# EAGLE design KimCard-r3 (EAGLE 5.11)
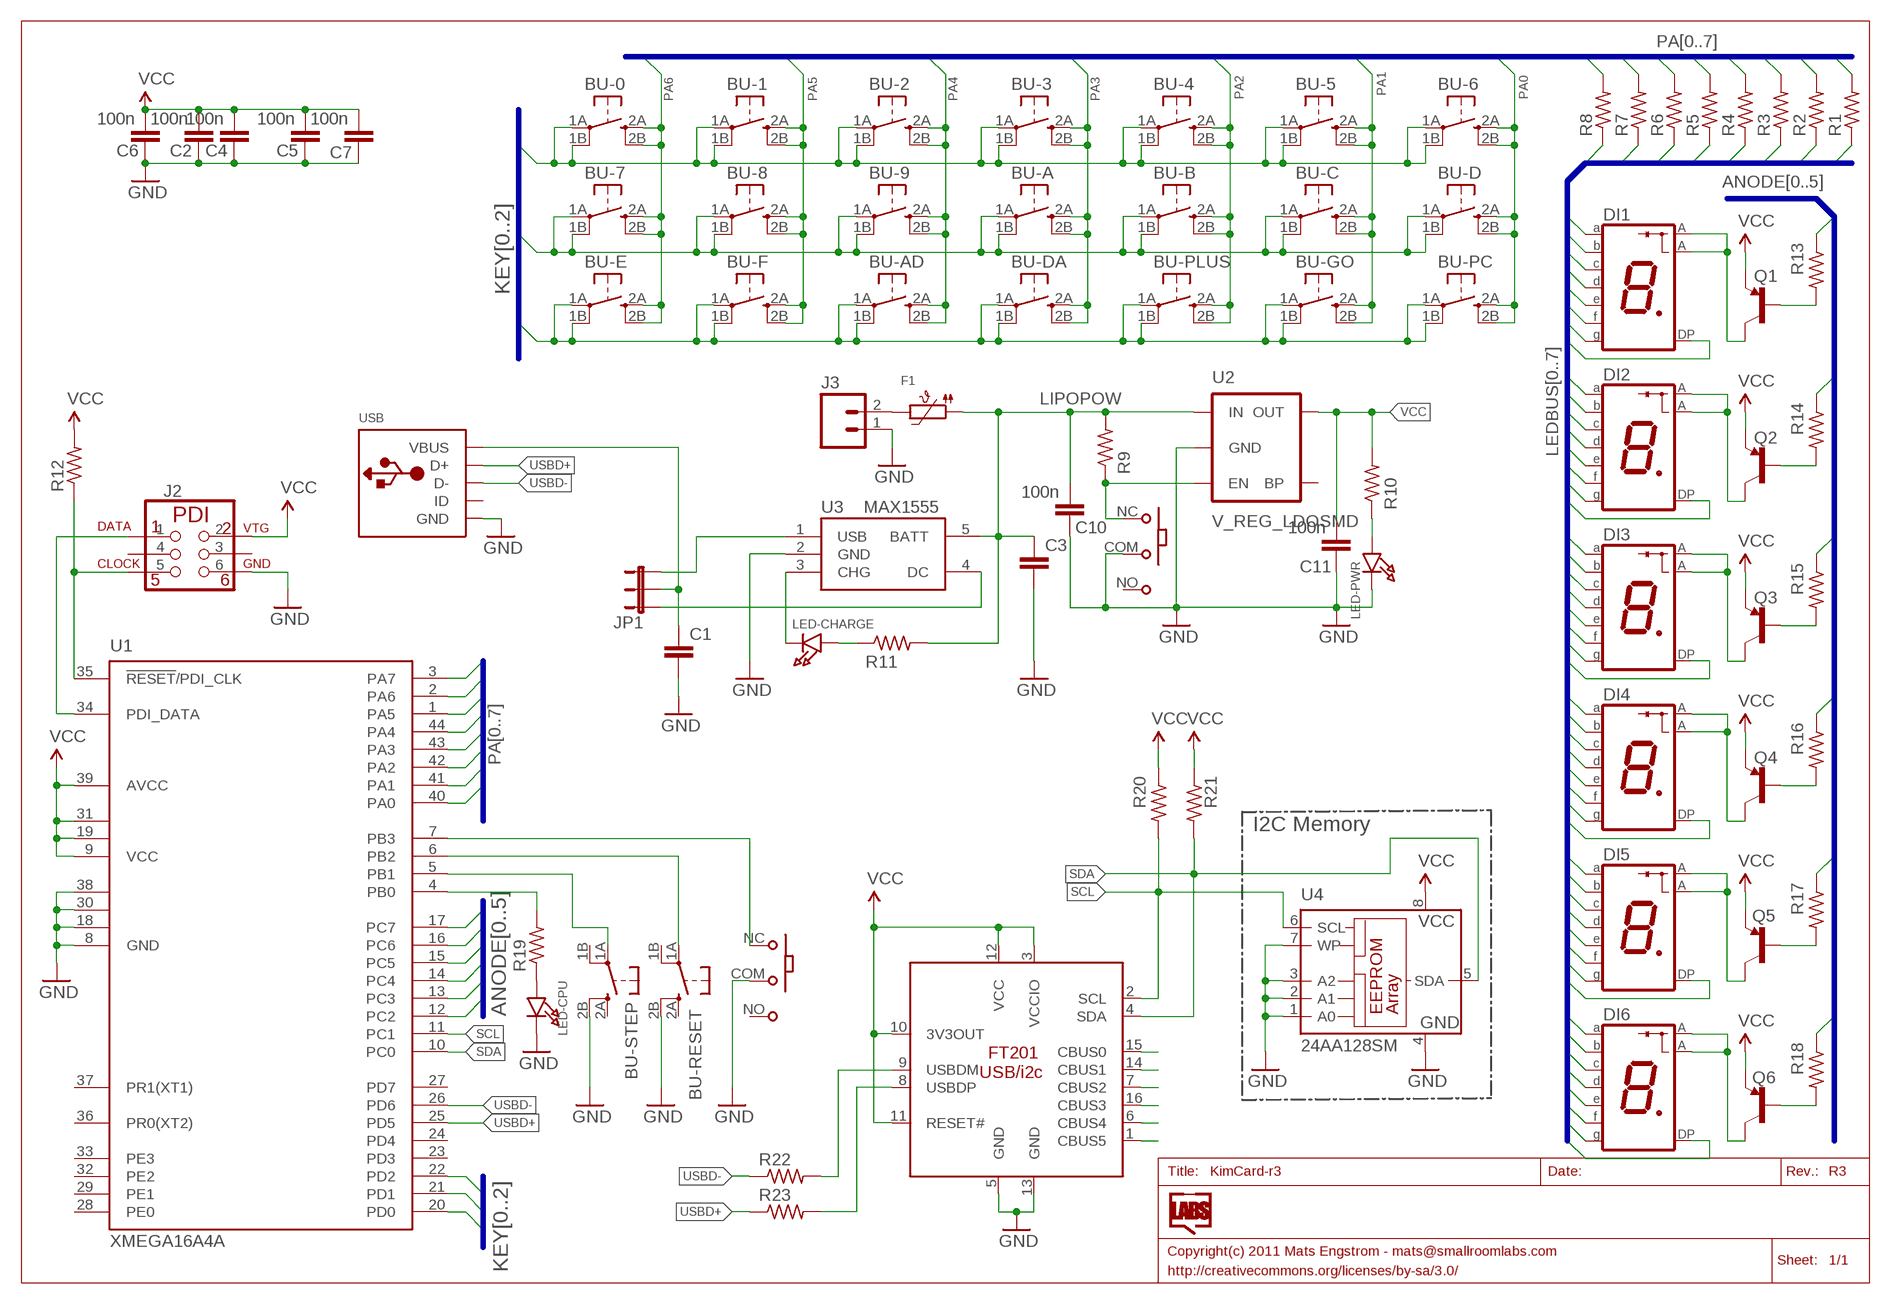
[diagram p0: schematic, sheet 1]

## Parts
BU-0  TACTILETAO1  [EVQ-Q2-TAO1]
BU-1  TACTILETAO1  [EVQ-Q2-TAO1]
BU-2  TACTILETAO1  [EVQ-Q2-TAO1]
BU-3  TACTILETAO1  [EVQ-Q2-TAO1]
BU-4  TACTILETAO1  [EVQ-Q2-TAO1]
BU-5  TACTILETAO1  [EVQ-Q2-TAO1]
BU-6  TACTILETAO1  [EVQ-Q2-TAO1]
BU-7  TACTILETAO1  [EVQ-Q2-TAO1]
BU-8  TACTILETAO1  [EVQ-Q2-TAO1]
BU-9  TACTILETAO1  [EVQ-Q2-TAO1]
BU-A  TACTILETAO1  [EVQ-Q2-TAO1]
BU-AD  TACTILETAO1  [EVQ-Q2-TAO1]
BU-B  TACTILETAO1  [EVQ-Q2-TAO1]
BU-C  TACTILETAO1  [EVQ-Q2-TAO1]
BU-D  TACTILETAO1  [EVQ-Q2-TAO1]
BU-DA  TACTILETAO1  [EVQ-Q2-TAO1]
BU-E  TACTILETAO1  [EVQ-Q2-TAO1]
BU-F  TACTILETAO1  [EVQ-Q2-TAO1]
BU-GO  TACTILETAO1  [EVQ-Q2-TAO1]
BU-PC  TACTILETAO1  [EVQ-Q2-TAO1]
BU-PLUS  TACTILETAO1  [EVQ-Q2-TAO1]
BU-RESET  TACTILETAO1  [EVQ-Q2-TAO1]
BU-STEP  TACTILETAO1  [EVQ-Q2-TAO1]
C1  CAP0805  [0805]
C2  100n  CAP0805  [0805]
C3  CAP0805  [0805]
C4  100n  CAP0805  [0805]
C5  100n  CAP0805  [0805]
C6  100n  CAP0805  [0805]
C7  100n  CAP0805  [0805]
C10  100n  CAP0805  [0805]
C11  100n  CAP0805  [0805]
DI1  7SEG-CA0.3"SMD  [KCSA03]
DI2  7SEG-CA0.3"SMD  [KCSA03]
DI3  7SEG-CA0.3"SMD  [KCSA03]
DI4  7SEG-CA0.3"SMD  [KCSA03]
DI5  7SEG-CA0.3"SMD  [KCSA03]
DI6  7SEG-CA0.3"SMD  [KCSA03]
F1  PTC1812  [PTC1812]
J2  PDI-EXTRA  [ISP-TOUCH-PDI-SOLDER]
J3  LIPO-BAT  M02-JST-2MM-SMT  [JST-2-SMD]
JP1  JUMPER-31-2  [SJ_3_PASTE1&2]
LED-CHARGE  LEDSMD0805  [CHIPLED_0805]
LED-CPU  LEDSMD0805  [CHIPLED_0805]
LED-PWR  LEDSMD0805  [CHIPLED_0805]
Q1  TRANSISTOR_PNPSMD  [SOT23-3]
Q2  TRANSISTOR_PNPSMD  [SOT23-3]
Q3  TRANSISTOR_PNPSMD  [SOT23-3]
Q4  TRANSISTOR_PNPSMD  [SOT23-3]
Q5  TRANSISTOR_PNPSMD  [SOT23-3]
Q6  TRANSISTOR_PNPSMD  [SOT23-3]
R1  RES0805A  [R0805A]
R2  RES0805A  [R0805A]
R3  RES0805A  [R0805A]
R4  RES0805A  [R0805A]
R5  RES0805A  [R0805A]
R6  RES0805A  [R0805A]
R7  RES0805A  [R0805A]
R8  RES0805A  [R0805A]
R9  RES0805A  [R0805A]
R10  RES0805A  [R0805A]
R11  RES0805A  [R0805A]
R12  RES0805A  [R0805A]
R13  RES0805A  [R0805A]
R14  RES0805A  [R0805A]
R15  RES0805A  [R0805A]
R16  RES0805A  [R0805A]
R17  RES0805A  [R0805A]
R18  RES0805A  [R0805A]
R19  RES0805A  [R0805A]
R20  RES0805A  [R0805A]
R21  RES0805A  [R0805A]
R22  RES0805A  [R0805A]
R23  RES0805A  [R0805A]
U1  XMEGA16A4A  [TQFP44]
U2  V_REG_LDOSMD  [SOT23-5]
U3  MAX1555  [SOT23-5]
U4  24AA128SM  [SO-08M]
U5  FT201-SSOP  [SSOP16]
U$1  SLIDESWITCHPCM12SMTR  [PCM12SMTR]
U$2  SLIDESWITCHPCM12SMTR  [PCM12SMTR]
USB  USBMINI-B  [MOLEX67503]

## Nets
CBUS0: U5.15(CBUS0)
CBUS1: U5.14(CBUS1)
CBUS2: U5.7(CBUS2)
CBUS3: U5.16(CBUS3)
CBUS4: U5.6(CBUS4)
CBUS5: U5.1(CBUS5)
CHRG-A: LED-CHARGE.C U3.3(CHG)
CHRG-B: LED-CHARGE.A R11.1
CPU: R19.2 U1.4(PB0)
DC-IN: JP1.1 U3.4(DC)
GND [pwr2]: BU-RESET.2B BU-STEP.2B C1.2 C2.1 C3.2 C4.1 C5.1 C6.1 C7.1 C10.1 C11.1 J2.6(GND) J3.1 LED-CPU.C LED-PWR.C U1.8(GND) U1.18(GND1) U1.30(GND2) U1.38(GND3) U2.2(GND) U3.2(GND) U4.1(A0) U4.2(A1) U4.3(A2) U4.4(GND) U4.7(WP) U5.5(GND) U5.13(GND) U$1.COM U$2.COM USB.GND
KEYROW0: BU-0.1A BU-0.1B BU-1.1A BU-1.1B BU-2.1A BU-2.1B BU-3.1A BU-3.1B BU-4.1A BU-4.1B BU-5.1A BU-5.1B BU-6.1A BU-6.1B U1.20(PD0)
KEYROW1: BU-7.1A BU-7.1B BU-8.1A BU-8.1B BU-9.1A BU-9.1B BU-A.1A BU-A.1B BU-B.1A BU-B.1B BU-C.1A BU-C.1B BU-D.1A BU-D.1B U1.21(PD1)
KEYROW2: BU-AD.1A BU-AD.1B BU-DA.1A BU-DA.1B BU-E.1A BU-E.1B BU-F.1A BU-F.1B BU-GO.1A BU-GO.1B BU-PC.1A BU-PC.1B BU-PLUS.1A BU-PLUS.1B U1.22(PD2)
LEDBUS0: DI1.P$7(A) DI2.P$7(A) DI3.P$7(A) DI4.P$7(A) DI5.P$7(A) DI6.P$7(A) R1.1
LEDBUS1: DI1.P$6(B) DI2.P$6(B) DI3.P$6(B) DI4.P$6(B) DI5.P$6(B) DI6.P$6(B) R2.1
LEDBUS2: DI1.P$4(C) DI2.P$4(C) DI3.P$4(C) DI4.P$4(C) DI5.P$4(C) DI6.P$4(C) R3.1
LEDBUS3: DI1.P$2(D) DI2.P$2(D) DI3.P$2(D) DI4.P$2(D) DI5.P$2(D) DI6.P$2(D) R4.1
LEDBUS4: DI1.P$1(E) DI2.P$1(E) DI3.P$1(E) DI4.P$1(E) DI5.P$1(E) DI6.P$1(E) R5.1
LEDBUS5: DI1.P$9(F) DI2.P$9(F) DI3.P$9(F) DI4.P$9(F) DI5.P$9(F) DI6.P$9(F) R6.1
LEDBUS6: DI1.P$10(G) DI2.P$10(G) DI3.P$10(G) DI4.P$10(G) DI5.P$10(G) DI6.P$10(G) R7.1
LEDBUS7: DI1.P$5(DP) DI2.P$5(DP) DI3.P$5(DP) DI4.P$5(DP) DI5.P$5(DP) DI6.P$5(DP) R8.1
LEDCA0: R13.1 U1.12(PC2)
LEDCA1: R14.1 U1.13(PC3)
LEDCA2: R15.1 U1.14(PC4)
LEDCA3: R16.1 U1.15(PC5)
LEDCA4: R17.1 U1.16(PC6)
LEDCA5: R18.1 U1.17(PC7)
LIPO+ [pwr1]: F1.P$2 J3.2
LIPOPOW [pwr2]: C3.1 C10.2 F1.P$1 R9.2 R11.2 U2.1(IN) U3.5(BATT)
N$3: C1.1 JP1.2 USB.VBUS
N$5: LED-PWR.A R10.1
N$7: LED-CPU.A R19.1
PA0: BU-6.2A BU-6.2B BU-D.2A BU-D.2B BU-PC.2A BU-PC.2B R1.2 U1.40(PA0)
PA1: BU-5.2A BU-5.2B BU-C.2A BU-C.2B BU-GO.2A BU-GO.2B R2.2 U1.41(PA1)
PA2: BU-4.2A BU-4.2B BU-B.2A BU-B.2B BU-PLUS.2A BU-PLUS.2B R3.2 U1.42(PA2)
PA3: BU-3.2A BU-3.2B BU-A.2A BU-A.2B BU-DA.2A BU-DA.2B R4.2 U1.43(PA3)
PA4: BU-2.2A BU-2.2B BU-9.2A BU-9.2B BU-AD.2A BU-AD.2B R5.2 U1.44(PA4)
PA5: BU-1.2A BU-1.2B BU-8.2A BU-8.2B BU-F.2A BU-F.2B R6.2 U1.1(PA5)
PA6: BU-0.2A BU-0.2B BU-7.2A BU-7.2B BU-E.2A BU-E.2B R7.2 U1.2(PA6)
PA7: R8.2 U1.3(PA7)
PDI_CLOCK: J2.5(CLOCK) R12.1 U1.35(!RESET!/PDI_CLK)
PDI_DATA: J2.1(DATA) U1.34(PDI_DATA)
POWER-ENABLE: R9.1 U2.3(EN) U$1.NC
Q1B: Q1.1(B) R13.2
Q1C: DI1.P$3(A) DI1.P$8(A) Q1.3(C)
Q2B: Q2.1(B) R14.2
Q2C: DI2.P$3(A) DI2.P$8(A) Q2.3(C)
Q3B: Q3.1(B) R15.2
Q3C: DI3.P$3(A) DI3.P$8(A) Q3.3(C)
Q4B: Q4.1(B) R16.2
Q4C: DI4.P$3(A) DI4.P$8(A) Q4.3(C)
Q5B: Q5.1(B) R17.2
Q5C: DI5.P$3(A) DI5.P$8(A) Q5.3(C)
Q6B: Q6.1(B) R18.2
Q6C: DI6.P$3(A) DI6.P$8(A) Q6.3(C)
RSET: BU-RESET.1A U1.6(PB2)
SCL: R20.2 U1.11(PC1) U4.6(SCL) U5.2(SCL)
SDA: R21.2 U1.10(PC0) U4.5(SDA) U5.4(SDA)
SST: U1.7(PB3) U$2.NC
STEP: BU-STEP.1A U1.5(PB1)
USB-IN: JP1.3 U3.1(USB)
USBD+: R23.1 U1.25(PD5) USB.D+
USBD-: R22.1 U1.26(PD6) USB.D-
USBDM: R22.2 U5.9(USBDM)
USBDP: R23.2 U5.8(USBDP)
VCC [pwr1]: C2.2 C4.2 C5.2 C6.2 C7.2 C11.2 J2.2(VTG) Q1.2(E) Q2.2(E) Q3.2(E) Q4.2(E) Q5.2(E) Q6.2(E) R10.2 R12.2 R20.1 R21.1 U1.9(VCC) U1.19(VCC1) U1.31(VCC2) U1.39(AVCC) U2.5(OUT) U4.8(VCC) U5.3(VCCIO) U5.10(3V3OUT) U5.11(RESET#) U5.12(VCC)
Unconnected: BU-RESET.1B BU-RESET.2A BU-STEP.1B BU-STEP.2A J2.3(N/C2) J2.4(N/C1) U1.23(PD3) U1.24(PD4) U1.27(PD7) U1.28(PE0) U1.29(PE1) U1.32(PE2) U1.33(PE3) U1.36(PR0(XT2)) U1.37(PR1(XT1)) U2.4(BP) U$1.NO U$2.NO USB.ID

## Buses
LEDBUS[0..7]
PA[0..7]
ANODE[0..5]
KEY[0..2]

## Notes on the sheet
- I2C Memory

## Library data of the parts
BU-0 BU-1-BU-9 BU-A BU-AD BU-B BU-C BU-D BU-DA BU-E BU-F BU-GO BU-PC BU-PLUS BU-RESET BU-STEP = SmallRoomLabs:TACTILE
C1-C7 C10 C11 = SparkFun:CAP: Capacitor Standard 0603 ceramic capacitor, and 0.1" leaded capacitor.
DI1-DI6 = SmallRoomLabs:7SEG-CA
F1 = microbuilder:PTC: PTC (Resettable Fuse) 1206 Package 250mA PTC (16V Max, Time-to-Trip: 0.08s) - Digikey: F2110CT-ND 1210 Package 100mA PTC (30V Max, Time-to-Trip: 0.6s) - Digikey: MF-USMF010-2CT-ND 1812 Package 750mA PTC (24V Max, Time-to-Trip: 0.2s) - Digikey: MF-MSMF075/24-2CT-ND
J2 = SmallRoomLabs:PDI
J3 = SparkFun:M02: Header 2 Standard 2-pin 0.1" header. Use with straight break away headers (SKU : PRT-00116), right angle break away headers (PRT-00553), swiss pins (PRT-00743), machine pins (PRT-00117), and female headers (PRT-00115). Molex polarized connector foot print use with SKU : PRT-08233 with associated crimp pins and housings.
JP1 = SparkFun:JUMPER-3
LED-CHARGE LED-CPU LED-PWR = SmallRoomLabs:LED
Q1-Q6 = SparkFun:TRANSISTOR_PNP
R1-R23 = SmallRoomLabs:RES
U1 = atmel:XMEGA16A4: MICROCONTROLLER Features High-performance, Low-power 8/16-bit AVR XMEGA Microcontroller Non-Volatile Program and Data Memories - 16 KB - 128 KB of In-System Self-Programmable Flash - 4 KB - 8 KB Boot Code Section with Independent Lock Bits - 1 KB - 2 KB EEPROM - 2 KB - 8 KB Internal SRAM Peripheral Features - Four-channel DMA Controller with support for external requests - Eight-channel Event System - Five 16-bit Timer/Counters Three Timer/Counters with 4 Output Compare or Input Capture channels Two Timer/Counters with 2 Output Compare or Input Capture channels High-Resolution Extensions on all Timer/Counters Advanced Waveform Extension on one Timer/Counter - Five USARTs IrDA Extension on one USART - Two Two-Wire Interfaces with dual address match (I2C and SMBus compatible) - Two SPIs (Serial Peripheral Interfaces) peripherals - AES and DES Crypto Engine - 16-bit Real Time Counter with Separate Oscillator - One Twelve-channel, 12-bit, 2 Msps Analog to Digital Converter - One Two-channel, 12-bit, 1 Msps Digital to Analog Converter - Two Analog Comparators with Window compare function - External Interrupts on all General Purpose I/O pins - Programmable Watchdog Timer with Separate On-chip Ultra Low Power Oscillator Special Microcontroller Features - Power-on Reset and Programmable Brown-out Detection - Internal and External Clock Options with PLL - Programmable Multi-level Interrupt Controller - Sleep Modes: Idle, Power-down, Standby, Power-save, Extended Standby - Advanced Programming, Test and Debugging Interfaces PDI (Program and Debug Interface) for programming, test and debugging I/O and Packages - 34 Programmable I/O Lines - 44 - lead TQFP - 44 - pad VQFN/QFN - 49 - ball VFBGA Operating Voltage - 1.6 - 3.6V Speed performance - 0 - 12 MHz @ 1.6 - 3.6V - 0 - 32 MHz @ 2.7 - 3.6V Drawn by Dipl.-Ing. (FH) Robert Siegler Created: 27.05.09; OC_FARNELL: unknown; OC_NEWARK: unknown
U2 = SparkFun:V_REG_LDO: Voltage Regulator LDO Standard 150mA LDO voltage regulator in SOT-23 layout. Micrel part MIC5205. BP (by-pass) pin is used to lower output noise with 470pF cap.
U3 = SparkFun:MAX1555: MAX1555 Lithium Charger IC SOT-23 Lithium Polymer charging IC. Schematic element and footprint proven. Spark Fun Electronics SKU : COM-00674
U4 = microchip:24*: Serial EEPROM I2C; MF: MICROCHIP; MPN: 24AA128-I/MS; OC_FARNELL: 1331285; OC_NEWARK: 92C6839
U5 = SmallRoomLabs:FT201
U$1 U$2 = Nerdlabs:SLIDESWITCH
USB = SmallRoomLabs:USB

## Net classes
0 default: width 0.203 mm, drill 0.305 mm, clearance 0.203 mm
1 pwr1: width 0.203 mm, drill 0.305 mm, clearance 0.203 mm
2 gnd1: width 0.203 mm, drill 0.305 mm, clearance 0.203 mm
3 pwr2: width 0.203 mm, drill 0.305 mm, clearance 0.203 mm

## Board
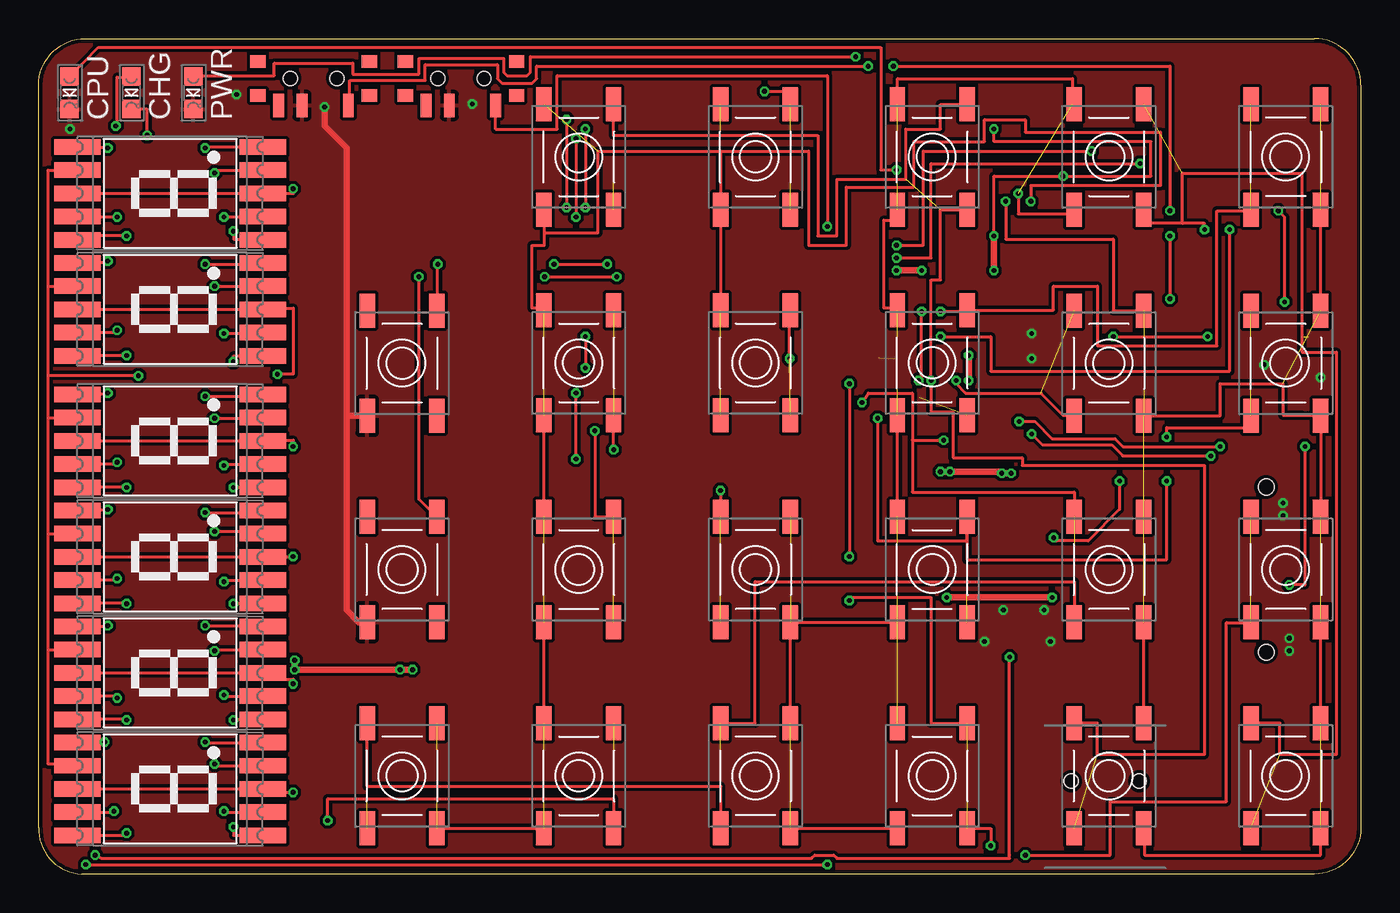
[diagram p1: board, top side]
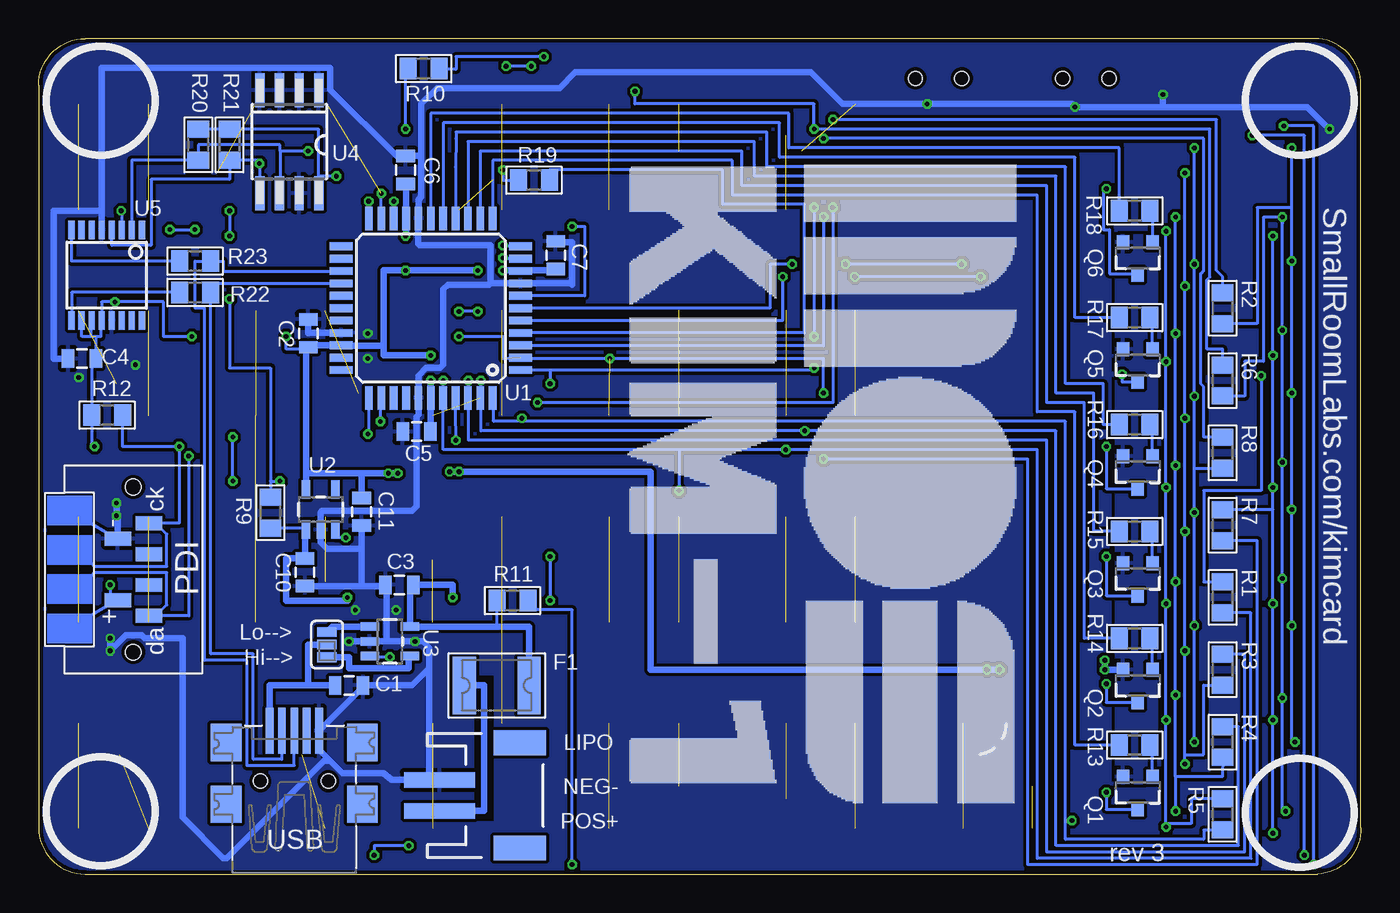
[diagram p2: board, bottom side, seen from below]

Size 85.5 x 54 mm. Coordinates in mm from the lower left corner, seen from the top.
Outline: 85.5,51 arc90 82.5,54 3,54 arc90 0,51 0,3 arc90 2.8,0 82.5,0 arc90 85.5,3 85.5,51
Copper layers (1*16): Top 0.035mm / dielectric 1.5mm / Bottom 0.035mm
Design rules "Fusion_eagle_rule_v1.1 *": minimum track width 6mil, minimum drill 12mil, track to track 6mil, track to pad 6mil, pad to pad 6mil, via to via 6mil, smd to smd 0mil, copper to edge 10mil, drill to drill 10mil, minimum pad ring 10mil, minimum via ring 6mil, stop-mask expansion 2mil, vias tented up to drill 100mil, thermal gap 10mil
tKeepout: area 65.4,22.1 to 67.7,24.1
bRestrict: area 56.1,3.5 to 57.3,12.8

### Footprints (pad centres in the part's own frame; a part is rotated, then mirrored left to right if it is on the bottom)
EVQ-Q2-TAO1 = smd 2.2 x 1: 1A -3.4,2.25; 1B 3.4,2.25; 2A -3.4,-2.25; 2B 3.4,-2.25
0805 = smd 0.8 x 1.2: 1 -0.9,0; 2 0.9,0
KCSA03 = smd 1 x 3: P$1 -3,-6; P$2 -1.5,-6; P$3 0,-6; P$4 1.5,-6; P$5 3,-6; P$6 3,6; P$7 1.5,6; P$8 0,6; P$9 -1.5,6; P$10 -3,6
PTC1812 = smd 1.5 x 3.7: P$1 -2.1,0; P$2 2.1,0
ISP-TOUCH-PDI-SOLDER = smd 0.9 x 1.7: 1 -3,-1; 2 -2,1; 3 -1,-1; 4 1,-1; 5 3,-1; 6 2,1 | hole 1: -5.334,0; 5.334,0
JST-2-SMD = smd 1 x 4.6: 1 -1,-3.7; 2 1,-3.7 | smd 1.6 x 3.4: NC1 -3.4,1.5; NC2 3.4,1.5
SJ_3_PASTE1&2 = smd 0.635 x 1.27: 1 -0.813,0; 2 0,0; 3 0.813,0
CHIPLED_0805 = smd 1.2 x 1.2: A 0,-1.05; C 0,1.05
SOT23-3 = smd 0.8 x 0.9: 1 -0.95,-1; 2 0.95,-1; 3 0,1.1
R0805A = smd 1.1 x 1.4: 1 -1,0; 2 1,0
TQFP44 = smd 1.5 x 0.5: 1 -5.8,4; 2 -5.8,3.2; 3 -5.8,2.4; 4 -5.8,1.6; 5 -5.8,0.8; 6 -5.8,0; 7 -5.8,-0.8; 8 -5.8,-1.6; 9 -5.8,-2.4; 10 -5.8,-3.2; 11 -5.8,-4; 23 5.8,-4; 24 5.8,-3.2; 25 5.8,-2.4; 26 5.8,-1.6; 27 5.8,-0.8; 28 5.8,0; 29 5.8,0.8; 30 5.8,1.6; 31 5.8,2.4; 32 5.8,3.2; 33 5.8,4 | smd 0.5 x 1.5: 12 -4,-5.8; 13 -3.2,-5.8; 14 -2.4,-5.8; 15 -1.6,-5.8; 16 -0.8,-5.8; 17 0,-5.8; 18 0.8,-5.8; 19 1.6,-5.8; 20 2.4,-5.8; 21 3.2,-5.8; 22 4,-5.8; 34 4,5.8; 35 3.2,5.8; 36 2.4,5.8; 37 1.6,5.8; 38 0.8,5.8; 39 0,5.8; 40 -0.8,5.8; 41 -1.6,5.8; 42 -2.4,5.8; 43 -3.2,5.8; 44 -4,5.8
SOT23-5 = smd 0.55 x 1.2: 1 -0.95,-1.3; 2 0,-1.3; 3 0.95,-1.3; 4 0.95,1.3; 5 -0.95,1.3
SO-08M = smd 0.6 x 2.2: 1 -1.905,-3.33; 2 -0.635,-3.33; 3 0.635,-3.33; 4 1.905,-3.33; 5 1.905,3.33; 6 0.635,3.33; 7 -0.635,3.33; 8 -1.905,3.33
SSOP16 = smd 0.4 x 1.2: 1 -2.25,-3.027; 2 -1.6,-3.027; 3 -0.95,-3.027; 4 -0.3,-3.027; 5 0.35,-3.027; 6 1,-3.027; 7 1.65,-3.027; 8 2.3,-3.027; 9 2.3,2.823; 10 1.65,2.823; 11 1,2.823; 12 0.35,2.823; 13 -0.3,2.823; 14 -0.95,2.823; 15 -1.6,2.823; 16 -2.25,2.823
PCM12SMTR = smd 0.7 x 1.5: COM 0.75,1.75; NC -2.25,1.75; NO 2.25,1.75 | smd 1 x 0.8: P$1 -3.6,-1.1; P$2 -3.6,1.1; P$3 3.6,1.1; P$4 3.6,-1.1 | hole 0.9: -1.5,0; 1.5,0
MOLEX67503 = smd 0.5 x 3: D+ 0,3.264; D- -0.8,3.264; GND 1.6,3.264; ID 0.8,3.264; VBUS -1.6,3.264 | smd 2 x 2.4: GND1 -4.4,-1.5; GND2 -4.4,2.5; GND3 4.4,2.5; GND4 4.4,-1.5 | hole 0.9: -2.2,0; 2.2,0

### Placement (x,y rotation side)
BU-0  80.64,6.35 270 top
BU-1  80.64,19.68 270 top
BU-2  80.64,33.02 270 top
BU-3  80.64,46.35 270 top
BU-4  69.21,6.35 270 top
BU-5  69.21,19.68 270 top
BU-6  69.21,33.02 270 top
BU-7  69.21,46.35 90 top
BU-8  57.78,6.35 90 top
BU-9  57.78,19.68 90 top
BU-A  57.78,33.05 90 top
BU-AD  34.92,6.35 90 top
BU-B  57.78,46.35 90 top
BU-C  46.35,6.35 270 top
BU-D  46.35,19.68 270 top
BU-DA  34.92,19.68 90 top
BU-E  46.35,33.05 90 top
BU-F  46.35,46.35 90 top
BU-GO  23.49,6.35 270 top
BU-PC  34.92,33.05 90 top
BU-PLUS  34.92,46.35 90 top
BU-RESET  23.49,33.02 270 top
BU-STEP  23.49,19.68 270 top
C1  65.43,12.19 0 bottom
C2  68.07,34.95 270 bottom
C3  62.18,18.69 180 bottom
C4  82.7,33.32 0 bottom
C5  61.06,28.6 0 bottom
C6  61.77,45.52 270 bottom
C7  52.07,40.01 270 bottom
C10  68.27,19.51 90 bottom
C11  64.62,23.42 90 bottom
DI1  8.5,5.5 90 top
DI2  8.5,13 90 top
DI3  8.5,20.5 90 top
DI4  8.5,28 90 top
DI5  8.5,36.5 90 top
DI6  8.5,44 90 top
F1  55.88,12.19 180 bottom
J2  79.37,19.68 90 bottom
J3  55.88,5.08 270 bottom
JP1  66.85,14.83 90 bottom
LED-CHARGE  6,50.5 180 top
LED-CPU  2,50.5 180 top
LED-PWR  10,50.5 180 top
Q1  14.43,5.28 180 bottom
Q2  14.43,12.19 180 bottom
Q3  14.43,19.1 180 bottom
Q4  14.43,26.01 180 bottom
Q5  14.43,32.92 180 bottom
Q6  14.43,39.83 180 bottom
R1  8.94,17.88 270 bottom
R2  8.94,36.58 90 bottom
R3  8.94,13.21 90 bottom
R4  8.94,8.53 90 bottom
R5  8.94,3.86 270 bottom
R6  8.94,31.9 90 bottom
R7  8.94,22.56 270 bottom
R8  8.94,27.23 90 bottom
R9  70.51,23.37 270 bottom
R10  60.6,52.07 180 bottom
R11  54.86,17.68 180 bottom
R12  81.08,29.67 180 bottom
R13  14.63,8.33 0 bottom
R14  14.63,15.24 0 bottom
R15  14.63,22.15 0 bottom
R16  14.63,29.06 0 bottom
R17  14.63,35.97 0 bottom
R18  14.63,42.88 0 bottom
R19  53.47,44.86 0 bottom
R20  75.18,47.14 270 bottom
R21  73.15,47.14 270 bottom
R22  75.39,37.59 180 bottom
R23  75.39,39.62 180 bottom
U1  60.15,36.58 180 bottom
U2  67.26,23.57 0 bottom
U3  62.79,15.04 270 bottom
U4  69.29,47.35 180 bottom
U5  81.08,38.61 180 bottom
U$1  17.78,51.44 180 top
U$2  27.3,51.44 180 top
U$3  [SRL-LOGO-STOP-5MM]  23.1,40.83 90 top
U$5  [SRL-LOGO-BSTOP-10MM]  84.33,41.25 0 top
USB  68.97,6 0 bottom

### Tracks (layer width: path | path; a pad name or v marks a point on that pad's centre or on a via)
CHRG-A  (via drill 0.3)
  Top 0.203: v3.66,1.22 4.06,1.02 49.99,1.02 50.19,1.22 51.41,1.22 51.61,1.02 62.79,1.02 62.79,1.22 v62.79,14.02 | v7.02,47.75 7.02,49.45 LED-CHARGE.C
  Bottom 0.203: v7.02,47.75 3.66,47.75 v3.66,1.22 | U3.3 64.09,14.02 v62.79,14.02
CHRG-B  (via drill 0.3)
  Top 0.203: v3.05,0.61 v51,0.61 | v4.98,48.36 5.08,48.36 5.08,51.51 6,51.51 LED-CHARGE.A
  Bottom 0.203: v3.05,0.61 3.05,48.36 v4.98,48.36 | v51,0.61 51,17.07 53.85,17.07 53.85,17.68 R11.1
CPU
  Bottom 0.203: 54.33,34.99 U1.4 35.96,34.98 35.96,43.28 41.25,43.28 41.25,45.52 52.47,45.52 R19.2
DC-IN
  Bottom 0.406: JP1.1 65.43,14.02 65.43,13.31 61.57,13.31 61.57,14.09 U3.4
GND  (via drill 0.3)
  Top 0.406: BU-STEP.2B 20.7,16.29 19.91,17.07 19.91,29.67 | 19.91,29.67 19.91,46.94 18.49,48.36 v18.49,49.58 | BU-RESET.2B 19.96,29.62 19.91,29.67
  Bottom 0.406: 60.76,46.43 60.76,43.79 60.95,43.6 U1.18 60.96,42.36 60.96,40.74 60.86,40.64 56.28,40.64 56.28,38.2 | 60.76,46.43 61.76,46.43 C6.1 62.37,46.42 66.65,50.7 66.65,52.12 81.43,52.12 U5.5 81.43,42.88 84.53,42.88 84.53,33.33 C4.1 | U1.30 68.04,34.98 68.07,34.95 C2.1 | 56.28,38.2 56.26,38.18 U1.8 51.08,38.18 51,38.1 51,40.84 52.01,40.84 C7.1 | 56.28,38.2 56.39,38.1 59.03,38.1 59.33,37.8 59.33,32.92 59.54,32.72 60.45,32.72 60.95,32.22 U1.38 60.95,29.68 61.06,29.57 61.06,23.77 61.36,23.47 67.16,23.47 67.26,23.37 U2.2 67.26,21.44 66.85,21.03 64.62,21.03 | 64.62,21.03 C11.1 | 62.99,15.04 v61.16,15.04 60.65,15.04 60.25,14.63 60.25,13.31 | 62.99,15.04 U3.2 v65.43,15.04 | 60.25,6.08 J3.1 | 60.25,6.08 62.69,6.08 63.19,6.5 65.84,6.5 66.65,7.32 | 66.65,7.32 67.36,8.03 USB.GND 64.53,12.1 C1.2 61.36,12.19 60.25,13.31 | 60.25,13.31 60.25,6.08 | 64.62,21.03 64.62,18.61 | 64.62,18.61 C10.1 | 64.62,18.61 63.08,18.61 | 63.08,18.61 C3.2 | 62.99,15.04 62.99,18.61 63.08,18.61 | 66.65,7.32 67.05,7.32 73.35,1.02 73.56,1.02 76.2,3.66 76.2,15.24 78.64,15.24 78.84,15.44 79.86,15.44 v80.87,14.43 v80.87,15.24 | v80.47,23.98 v80.47,23.16 80.37,23.07 J2.6 | 12.8,49.58 3.45,49.58 v2.03,48.16 | 12.8,49.58 v18.49,49.58 18.69,49.78 v28.04,49.78 33.53,49.78 35.56,51.82 50.8,51.82 51.81,50.8 59.74,50.8 60.76,49.78 60.76,46.43 | 12.8,49.58 v12.8,50.39
  other vias: 79.25,32.92 64.21,34.95 64.21,33.32 82.9,32.11 62.38,17.07 65.02,17.07
  pour Top: 2.8,0 82.5,0 arc90 85.5,3 85.5,51 arc90 82.5,54 3,54 arc90 0,51 0,3 arc90
  pour Bottom (rank 2): 2.8,0 82.5,0 arc90 85.5,3 85.5,51 arc90 82.5,54 3,54 arc90 0,51 0,3 arc90
KEYROW0  (via drill 0.3)  (7 unrouted)
  Top 0.203: BU-0.1A BU-1.1B | BU-1.1A BU-2.1B 81.67,29.67 80.47,29.67 80.47,31.7 76.4,31.7 76.4,29.62 BU-6.1B | BU-2.1A BU-3.1B | BU-4.1B 71.52,2.95 71.52,1.22 82.89,1.22 BU-0.1B | BU-4.1A BU-5.1B | BU-6.1A 69.49,36.42 69.49,41.05 62.53,41.05 v62.53,43.48
  Bottom 0.203: U1.20 62.53,42.38 v62.53,43.48
KEYROW1  (via drill 0.3)  (7 unrouted)
  Top 0.203: BU-C.1B BU-8.1A | BU-9.1A BU-D.1B BU-C.1A | BU-B.1B 55.53,51.41 66.85,51.41 66.85,49.76 BU-7.1B | BU-B.1A 55.53,42.27 54.66,42.27 54.66,36.58 55.53,36.58 | BU-A.1B 55.53,36.58 | 55.53,36.58 55.68,36.58 | BU-9.1B BU-A.1A | BU-7.1A 66.96,42.67 63.35,42.67 v63.35,43.99
  Bottom 0.203: U1.21 v63.35,43.99
KEYROW2  (via drill 0.3)  (7 unrouted)
  Top 0.203: BU-GO.1B BU-AD.1A | BU-AD.1B BU-DA.1A | BU-DA.1B BU-PC.1A | BU-PC.1B 32.67,36.58 31.9,36.58 31.9,40.64 32.71,40.64 32.71,41.45 | 44.1,46.74 36.17,46.74 36.17,41.45 32.71,41.45 | 32.71,41.45 32.71,42.95 BU-PLUS.1A | BU-E.1B BU-F.1A 44.1,46.74 | 44.1,46.74 49.78,46.74 49.78,40.64 52.22,40.64 52.22,44.4 56.59,44.4 56.59,47.35 61.16,47.35 61.16,48.77 63.8,48.77 63.8,47.95 72.54,47.95 72.54,44.5 64.16,44.5 v64.16,43.48
  Bottom 0.203: U1.22 v64.16,43.48
LEDBUS0  (via drill 0.3)
  Top 0.203: DI6.P$7 0.61,45.5 0.61,38 | DI1.P$7 2.3,7.11 0.61,7.11 0.61,14.5 | 0.61,29.5 DI4.P$7 | 0.61,22 0.61,29.5 | 0.61,38 DI5.P$7 | 0.61,29.5 0.61,32.26 | 0.61,32.26 0.61,38 | 0.61,22 DI3.P$7 | 0.61,14.5 0.61,22 | 0.61,14.5 DI2.P$7 | v6.45,32.21 6.45,32.26 0.61,32.26
  Bottom 0.203: R1.1 10.16,18.88 10.16,24.79 6.45,24.79 v6.45,32.21
LEDBUS1  (via drill 0.3)
  Top 0.203: DI1.P$6 4.27,8.5 v4.27,8.53 | v4.47,46.94 2.3,46.94 DI6.P$6 | DI5.P$6 4.47,39.5 v4.47,39.62 | DI4.P$6 4.47,31 v4.47,31.09 | DI3.P$6 4.27,23.5 v4.47,23.57 | DI2.P$6 4.47,16 v4.47,16.05
  Bottom 0.203: v4.27,8.53 4.47,8.53 v4.47,16.05 v4.47,23.57 v4.47,31.09 v4.47,39.62 4.47,43.08 | 4.47,43.08 v4.47,46.94 | R2.1 6.7,35.58 6.7,43.08 4.47,43.08
LEDBUS2  (via drill 0.3)
  Top 0.203: DI1.P$4 11.38,7 v11.38,7.11 | v11.38,45.31 11.38,45.5 DI6.P$4 | DI5.P$4 v11.38,38 | DI4.P$4 14.5,29.46 v11.38,29.46 | DI3.P$4 14.5,22.15 v11.38,22.15 | DI2.P$4 11.38,14.5 v11.38,14.43
  Bottom 0.203: v11.38,7.11 11.38,7.72 | 11.38,7.72 v11.38,14.43 v11.38,22.15 v11.38,29.46 v11.38,38 v11.38,45.31 | R3.1 10.16,12.21 10.16,7.72 11.38,7.72
LEDBUS3  (via drill 0.3)
  Top 0.203: DI1.P$2 11.99,4 v11.99,4.06 | v11.99,34.95 14.5,34.95 DI5.P$2 | DI2.P$2 11.99,11.5 v11.99,11.58 | DI3.P$2 11.99,19 v11.99,18.9 | DI4.P$2 11.99,26.5 v11.99,26.42 | DI6.P$2 11.99,42.5 v11.99,42.47
  Bottom 0.203: 11.99,6.3 v11.99,4.06 | 11.99,6.3 v11.99,11.58 v11.99,18.9 v11.99,26.42 v11.99,34.95 v11.99,42.47 | 11.99,6.3 8.96,6.3 R4.1
LEDBUS4  (via drill 0.3)
  Top 0.203: DI1.P$1 12.6,2.5 v12.6,3.05 | DI6.P$1 14.5,41.05 12.6,41.05 v12.6,41.55 | DI2.P$1 12.6,10 v12.6,9.96 | DI3.P$1 12.6,17.5 v12.6,17.48 | DI4.P$1 v12.6,25 v12.6,24.99 | DI5.P$1 12.6,33.5 v12.6,33.12
  Bottom 0.203: 12.6,3.25 v12.6,3.05 | 12.6,3.25 v12.6,9.96 v12.6,17.48 v12.6,24.99 v12.6,33.12 v12.6,41.55 | R5.1 10.97,4.86 10.97,3.25 12.6,3.25
LEDBUS5  (via drill 0.3)
  Top 0.203: DI1.P$9 4.88,4 v4.88,4.06 | v5.08,42.47 2.3,42.47 DI6.P$9 | DI2.P$9 5.08,11.5 v5.08,11.38 | DI3.P$9 5.08,19 v5.08,19.1 | DI4.P$9 5.08,26.5 v5.08,26.62 | DI5.P$9 5.08,35 v5.08,35.15
  Bottom 0.203: v4.88,4.06 5.08,4.06 v5.08,11.38 v5.08,19.1 v5.08,26.62 v5.08,35.15 v5.08,42.47 | v5.08,42.47 5.08,42.06 | v5.08,42.47 6.3,42.47 6.3,33.14 7.52,33.14 7.52,30.89 8.94,30.89 R6.1
LEDBUS6  (via drill 0.3)
  Top 0.203: DI1.P$10 5.69,2.5 v5.69,2.64 | v5.69,41.25 2.3,41.25 DI6.P$10 | DI2.P$10 5.69,10 v5.69,9.96 | DI3.P$10 5.69,17.5 v5.69,17.48 | DI4.P$10 v5.69,25 v5.69,24.99 | DI5.P$10 5.69,33.5 v5.69,33.53
  Bottom 0.203: v5.69,2.64 v5.69,9.96 v5.69,17.48 5.69,23.55 | v5.69,41.25 v5.69,33.53 v5.69,24.99 5.69,23.55 | 5.69,23.55 R7.1
LEDBUS7  (via drill 0.3)
  Top 0.203: DI1.P$5 10.77,8.5 v10.77,8.53 | v10.77,46.94 10.77,47 DI6.P$5 | DI5.P$5 14.5,39.42 v10.77,39.42 | DI4.P$5 14.5,30.89 v10.77,30.89 | DI3.P$5 14.5,23.37 v10.77,23.37 | DI2.P$5 14.5,16.05 v10.77,16.05
  Bottom 0.203: v10.77,8.53 v10.77,16.05 v10.77,23.37 10.77,26.23 | v10.77,46.94 v10.77,39.42 v10.77,30.89 10.77,26.23 | 10.77,26.23 R8.1
LEDCA0
  Bottom 0.203: U1.12 56.15,46.13 40.64,46.13 40.64,43.89 20.93,43.89 20.93,29.87 18.49,29.87 18.49,8.33 R13.1
LEDCA1
  Bottom 0.203: U1.13 56.95,46.74 40.03,46.74 40.03,44.5 20.32,44.5 20.32,30.48 17.88,30.48 17.88,15.24 R14.1
LEDCA2
  Bottom 0.203: U1.14 57.75,47.35 39.22,47.35 39.22,45.11 19.71,45.11 19.71,31.09 17.27,31.09 17.27,22.15 R15.1
LEDCA3
  Bottom 0.203: U1.15 58.55,45.72 58.52,47.55 58.52,47.95 38.4,47.95 38.4,45.72 19.1,45.72 19.1,31.7 16.66,31.7 16.66,29.06 R16.1
LEDCA4
  Bottom 0.203: U1.16 59.35,46.33 59.33,48.16 59.33,48.56 37.59,48.56 37.59,46.33 18.49,46.33 18.49,35.97 R17.1
LEDCA5
  Bottom 0.203: U1.17 60.15,46.94 60.15,49.17 36.98,49.17 36.98,46.94 15.63,46.94 R18.1
LIPO+
  Bottom 0.406: J3.2 56.69,4.08 56.69,12.19 F1.P$2
LIPOPOW  (via drill 0.3)
  Top 0.406: v58.72,17.88 v65.53,17.88
  Bottom 0.203: R11.2 55.86,15.99 55.88,15.99 | U2.1 68.21,22.37 R9.2
  Bottom 0.406: F1.P$1 53.78,15.99 55.88,15.99 U3.5 61.49,18.69 C3.1 58.72,18.69 v58.72,17.88 | U2.1 68.27,21.61 C10.2 68.27,20.42 69.49,20.42 69.49,17.68 65.53,17.68 v65.53,17.88
N$3
  Bottom 0.406: USB.VBUS 70.57,12.19 68.07,12.19 | 68.07,12.19 C1.1 | JP1.2 68.07,14.83 68.07,12.19
N$5  (via drill 0.3)
  Top 0.203: LED-PWR.A 10.16,51.61 15.24,51.61 15.24,52.43 20.32,52.43 20.32,51.71 24.59,51.71 24.59,52.73 30.07,52.73 30.07,51.82 30.28,51.61 31.6,51.61 31.8,51.82 31.8,52.83 v52.83,52.83
  Bottom 0.203: v52.83,52.83 58.52,52.83 58.52,52.02 59.6,52.02 R10.1
N$7  (via drill 0.3)
  Top 0.203: LED-CPU.A 3.86,53.44 54.46,53.44 54.46,45.52 v55.47,45.52
  Bottom 0.203: R19.1 55.47,44.86 v55.47,45.52
PA0  (via drill 0.3)  (3 unrouted)
  Top 0.203: v59.33,31.9 59.33,31.7 59.94,31.09 64.82,31.09 66.24,29.67 66.92,29.67 BU-6.2B | BU-PC.2A 37.18,29.64 v37.18,27.43 | v44.09,24.79 44.1,24.79 BU-D.2A
  Bottom 0.203: R1.2 7.11,16.88 7.11,1.02 20.93,1.02 20.93,27.43 v37.18,27.43 44.09,27.43 | 44.09,27.43 59.35,27.43 U1.40 59.35,31.09 v59.33,31.9 | 44.09,27.43 v44.09,24.79
PA1  (via drill 0.3)  (3 unrouted)
  Top 0.203: v53.24,30.48 53.64,31.09 56.49,31.09 56.49,28.04 | v34.14,48.77 v34.14,43.08 | BU-C.2B 44.09,5.69 21.24,5.69 BU-GO.2A | BU-5.2B 66.96,18.9 46.33,18.9 46.33,9.75 BU-C.2A | 56.49,28.04 v58.52,28.04 | BU-5.2A 66.96,24.69 56.49,24.69 56.49,28.04
  Bottom 0.203: R2.2 8.94,38.61 9.35,39.01 9.35,48.77 v34.14,48.77 | v53.24,30.48 34.14,30.48 v34.14,43.08 | v58.52,28.04 58.55,29.87 U1.41
PA2  (via drill 0.3)  (3 unrouted)
  Top 0.203: BU-PLUS.2B 37.17,47.75 50.39,47.75 50.39,41.25 51.61,41.25 51.61,44.91 56.08,44.91 56.08,48.16 58.32,48.16 58.32,49.76 BU-B.2B | BU-B.2A 58.32,42.95 58.32,38.41 57.71,38.41 v57.71,31.9 57.71,29.87 59.13,29.87 59.13,26.92 63.6,26.92 63.6,26.42 75.39,26.42 75.39,7.72 68.48,7.72 68.48,9.75 BU-4.2A
  Bottom 0.203: R3.2 7.52,14.21 7.52,1.42 20.32,1.42 20.32,28.04 57.71,28.04 57.71,30.78 | 57.71,30.78 v57.71,31.9 | 57.71,30.78 U1.42
PA3  (via drill 0.3)  (3 unrouted)
  Top 0.203: BU-3.2B 78.39,42.88 76.2,42.88 76.2,34.14 68.48,34.14 68.48,38 65.63,38 65.63,36.45 BU-A.2B 60.03,36.37 v58.32,36.37 | v56.89,31.9 57.1,32.11 v57.1,36.37 | v35.96,28.65 35.96,23.09 BU-DA.2B
  Bottom 0.203: R4.2 7.92,9.53 7.92,1.83 19.71,1.83 19.71,28.65 v35.96,28.65 56.89,28.65 56.89,30.78 | 56.89,30.78 U1.43 | 56.89,30.78 v56.89,31.9 | v57.1,36.37 v58.32,36.37
PA4  (via drill 0.3)  (3 unrouted)
  Top 0.203: BU-AD.2A 37.17,4.88 18.69,4.88 v18.69,3.45 | v54.25,29.46 54.25,21.54 60.03,21.54 BU-9.2B 60.03,20.32 72.95,20.32 v72.95,25.4 | v72.95,28.25 72.95,28.85 78.43,28.85 78.43,29.62 BU-2.2B
  Bottom 0.203: R5.2 8.96,2.85 10.16,2.85 10.16,2.23 19.1,2.23 19.1,3.45 | 19.1,3.45 19.1,29.26 54.25,29.26 | 54.25,29.26 56.08,29.26 56.08,30.78 U1.44 | 19.1,3.45 v18.69,3.45 | 54.25,29.26 v54.25,29.46 | v72.95,25.4 v72.95,28.25
PA5  (via drill 0.3)  (3 unrouted)
  Top 0.203: v35.36,34.75 v35.36,32.72 | v35.36,48.16 v35.36,43.08 | BU-1.2B 78.39,16.26 76.81,16.26 76.81,4.67 69.29,4.67 69.29,1.22 v63.8,1.22 | v61.57,1.83 61.57,2.95 BU-8.2A | BU-F.2B 48.6,50.6 v46.94,50.6 | BU-8.2B 57.71,9.75 57.71,17.88 52.42,17.88 v52.42,17.68 | v52.42,31.7 v52.42,20.52
  Bottom 0.203: R6.2 8.94,33.93 9.96,33.93 9.96,38.41 9.75,38.61 9.75,48.16 v35.36,48.16 35.36,49.78 46.94,49.78 v46.94,50.6 | v35.36,32.72 35.36,32.58 52.42,32.58 | 52.42,32.58 U1.1 | v35.36,43.08 v35.36,34.75 | v63.8,1.22 63.8,1.83 v61.57,1.83 | v52.42,20.52 v52.42,17.68 | 52.42,32.58 v52.42,31.7
PA6  (via drill 0.3)  (4 unrouted)
  Top 0.203: v34.75,26.82 v34.75,31.09 | BU-E.2B 48.56,36.45 v48.56,33.33 | BU-7.2A 71.46,42.06 73.96,42.06 | 73.96,42.06 73.96,45.31 81.68,45.31 81.68,33.73 83.92,33.73 83.92,7.72 80.26,7.72 80.26,9.75 BU-0.2A | v58.32,34.75 61.57,34.75 61.57,32.51 77.01,32.51 v77.01,41.66 | v75.39,41.66 75.39,42.06 73.96,42.06
  Bottom 0.203: R7.2 6.7,21.55 6.7,0.61 21.54,0.61 21.54,26.82 v34.75,26.82 | v34.75,31.09 34.75,33.33 v48.56,33.33 55.47,33.33 55.47,34.75 v58.32,34.75 | v77.01,41.66 v75.39,41.66
PA7  (via drill 0.3)
  Top 0.203: v34.75,47.55 v34.75,42.47
  Bottom 0.203: R8.2 8.94,28.25 10.16,28.25 10.16,31.5 10.36,31.7 10.36,38.81 10.16,39.01 10.16,47.55 v34.75,47.55 | U1.3 54.35,34.14 34.75,34.14 v34.75,42.47
PDI_CLOCK  (via drill 0.3)
  Top 0.203: v76.4,27.64 70.1,27.64 69.59,28.14 65.53,28.14 64.41,29.26 v63.4,29.26
  Bottom 0.203: J2.5 76.4,22.68 v76.4,27.64 80.08,27.64 R12.1 | v63.4,29.26 63.35,30.68 U1.35
PDI_DATA  (via drill 0.3)
  Top 0.203: v75.79,27.03 70.1,27.03 69.39,27.74 64.92,27.74 v64.21,28.45
  Bottom 0.203: J2.1 75.79,16.68 v75.79,27.03 | v64.21,28.45 64.15,28.45 U1.34
POWER-ENABLE  (via drill 0.3)
  Top 0.203: U$1.NC 20.12,49.77 20.12,51.31 24.99,51.31 24.99,52.32 29.67,52.32 29.67,51.41 29.97,51.1 31.9,51.1 32.21,51.41 32.21,52.22 v53.64,52.22 | v73.15,41.25 v73.15,37.19 | v73.15,42.88 73.15,52.22 v55.27,52.22 | v65.63,21.74 65.84,21.54 67.87,21.54 69.9,23.57 v69.9,25.4
  Bottom 0.203: 70.51,25.4 R9.1 70.51,24.79 | 70.51,25.4 70.51,32.72 73.15,32.72 v73.15,37.19 | v73.15,42.88 v73.15,41.25 | v53.64,52.22 v55.27,52.22 | U2.3 66.31,21.74 v65.63,21.74 | 70.51,25.4 v69.9,25.4
Q1B
  Bottom 0.203: Q1.1 13.48,8.18 R13.2
Q1C  (via drill 0.3)
  Top 0.203: DI1.P$8 DI1.P$3 14.5,5.28 v16.46,5.28
  Bottom 0.203: v16.46,5.28 16.46,4.18 Q1.3
Q2B
  Bottom 0.203: Q2.1 13.48,15.29 R14.2
Q2C  (via drill 0.3)
  Top 0.203: DI2.P$8 DI2.P$3 15.04,13 15.04,12.6 16.46,12.6 v16.46,12.29
  Bottom 0.203: v16.46,12.29 16.46,11.09 Q2.3
Q3B
  Bottom 0.203: Q3.1 13.48,21.79 R15.2
Q3C  (via drill 0.3)
  Top 0.203: DI3.P$8 DI3.P$3 14.5,20.52 v16.46,20.52
  Bottom 0.203: v16.46,20.52 16.46,18 Q3.3
Q4B
  Bottom 0.203: Q4.1 13.48,28.9 R16.2
Q4C  (via drill 0.3)
  Top 0.203: DI4.P$8 DI4.P$3 14.5,28.04 16.46,28.04 v16.46,27.64
  Bottom 0.203: v16.46,27.64 16.46,24.91 Q4.3
Q5B
  Bottom 0.203: Q5.1 13.48,35.81 R17.2
Q5C  (via drill 0.3)
  Top 0.203: DI5.P$8 DI5.P$3 14.5,36.58 16.46,36.58 16.46,32.31 v15.44,32.31
  Bottom 0.203: v15.44,32.31 15.44,31.82 Q5.3
Q6B
  Bottom 0.203: Q6.1 13.48,42.92 R18.2
Q6C  (via drill 0.3)
  Top 0.203: DI6.P$8 DI6.P$3 16.46,44 v16.46,44.3
  Bottom 0.203: Q6.3 14.43,38.81 16.25,38.81 16.25,41.66 16.66,41.66 16.66,44.3 v16.46,44.3
RSET  (via drill 0.3)
  Top 0.203: BU-RESET.1A 25.8,36.46 v25.8,39.42 | v33.32,39.42 v36.78,39.42
  Bottom 0.203: v25.8,39.42 v33.32,39.42 | v36.78,39.42 38.2,39.42 38.2,36.58 U1.6
SCL  (via drill 0.3)
  Top 0.203: v55.47,40.64 57.2,40.64 57.2,46.74 v68.07,46.74
  Bottom 0.203: U5.2 79.48,46.14 R20.2 75.18,47.14 69.9,47.14 69.9,46.74 | U1.11 55.47,40.58 v55.47,40.64 | 69.9,46.74 69.9,44.02 U4.6 | v68.07,46.74 69.9,46.74
SDA  (via drill 0.3)
  Top 0.203: v55.47,39.83 57.71,39.83 57.71,45.92 v71.22,45.92
  Bottom 0.203: 71.19,45.92 U4.5 71.12,44.02 | 71.19,45.92 71.19,46.14 R21.2 73.15,44.91 78.23,44.91 78.23,40.64 80.78,40.64 U5.4 | 54.35,39.83 U1.10 55.47,39.78 v55.47,39.83 | v71.22,45.92 71.19,45.92
SST  (via drill 0.3)
  Top 0.203: U$2.NC 29.55,48.16 33.53,48.16 33.53,51.61 51,51.61 v51,41.86
  Bottom 0.203: U1.7 50.19,37.38 50.19,41.86 v51,41.86
STEP  (via drill 0.3)
  Top 0.203: BU-STEP.1A 24.59,24.22 v24.59,38.61 | v32.71,38.61 v37.39,38.61
  Bottom 0.203: v24.59,38.61 v32.71,38.61 | U1.5 37.39,35.78 v37.39,38.61
USB-IN
  Bottom 0.406: U3.1 66.51,15.99 JP1.3
USBD+
  Bottom 0.203: USB.D+ 68.97,7.01 72.03,7.01 72.03,13.82 74.78,13.82 74.78,36.58 75.39,36.58 75.39,39.62 R23.1 73.56,39.62 73.56,38.98 U1.25
USBD-
  Bottom 0.203: U1.26 74.39,38.18 R22.1 74.37,37.59 74.37,14.22 71.63,14.22 71.63,7.42 69.77,7.42 USB.D-
USBDM
  Bottom 0.203: R22.2 83.38,37.59 U5.9
USBDP
  Bottom 0.203: R23.2 83.38,39.62 U5.8
VCC  (via drill 0.3)  (1 unrouted)
  Top 0.203: v69.49,34.75 v75.59,34.75 | v80.16,42.88 80.57,42.47 v80.57,36.98 | v61.77,41.25 61.77,45.11 v66.24,45.11 71.93,45.11 71.93,47.35 61.77,47.35 v61.77,48.16 | v80.87,18.69 81.89,18.69 v81.89,27.64
  Top 0.406: v57.1,39.01 v55.47,39.01 | v61.77,39.01 v61.77,41.25 | v60.15,33.53 v60.15,31.9 | v16.56,13.82 v16.56,13.21 v23.37,13.21 v24.18,13.21 | v62.89,25.91 v62.28,25.91 62.28,26.01 v58.93,26.01 v58.32,26.01
  Bottom 0.203: 67.38,45.11 67.38,48.14 R21.1 R20.1 75.18,48.16 | 61.75,44.62 C6.2 | 54.35,39.01 U1.9 | U5.10 82.7,35.78 82.7,34.75 81.8,34.75 | 81.8,34.75 C4.2 82.08,33.73 R12.2 82.08,27.84 v81.89,27.64 | 81.8,34.75 81.48,34.75 81.48,35.78 U5.12 81.43,36.98 v80.57,36.98 77.42,36.98 77.42,34.75 v75.59,34.75 | U5.11 82.09,35.78 82.09,34.75 | C2.2 68.07,33.93 69.49,33.93 v69.49,34.75 | v80.16,42.88 80.13,42.88 U5.3 | 67.46,44.02 U4.8 67.38,45.11 | v66.24,45.11 67.38,45.11 | R10.2 61.77,52.07 v61.77,48.16 | J2.2 80.87,17.68 v80.87,18.69
  Bottom 0.406: 61.75,44.62 U1.19 61.75,41.25 v61.77,41.25 | 67.98,34.18 U1.31 65.95,34.14 63.19,34.14 | 68.21,25.91 68.21,34.05 C2.2 | v60.15,33.53 63.19,33.53 63.19,34.14 | 63.19,34.14 63.19,39.01 v61.77,39.01 v57.1,39.01 | v55.47,39.01 54.35,39.01 52.45,39.01 C7.2 | v60.15,31.9 U1.39 60.15,28.74 C5.2 | Q2.2 15.38,13.21 v16.56,13.21 v16.56,13.82 | v23.37,13.21 45.92,13.21 45.92,26.01 v58.93,26.01 | 68.21,25.91 U2.5 | 64.62,25.91 C11.2 | 64.62,25.91 68.21,25.91 | v62.28,25.91 64.62,25.91
  Bottom 0.508: C2.2 67.98,34.18
  pour Bottom: 13.21,41.25 15.85,41.25 15.85,5.89 13.21,5.89

### Text on the board
tPlace: CPU | CHG | PWR
bPlace: SmallRoomLabs.com/kimcard | Lo--> | Hi--> | LIPO | NEG- | POS+ | rev 3